# EAGLE schematic Circular_Touch_Pad (EAGLE 9.3.0)
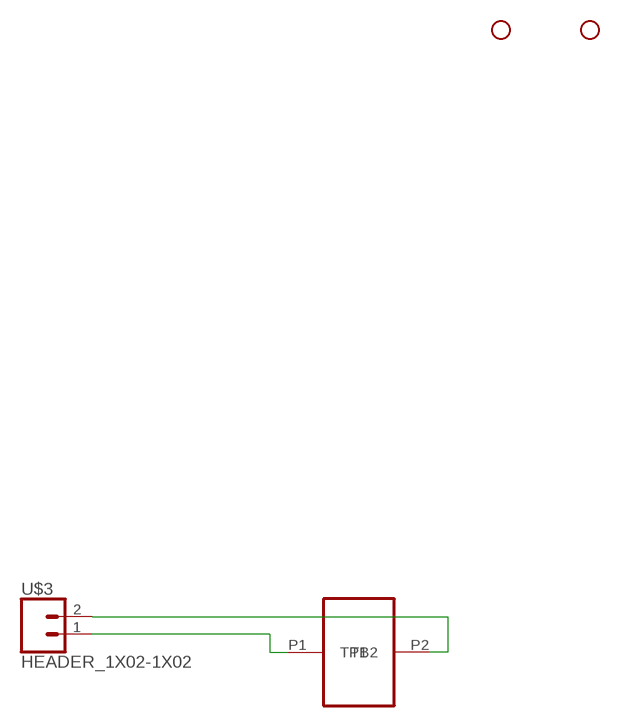
[diagram p0: schematic, sheet 1]

## Parts
H1  STAND-OFF-  [STAND-OFF]
H2  STAND-OFF-  [STAND-OFF]
U$1  TOUCH-PAD-CIRCLE  [TOUCH-PAD2]
U$3  HEADER_1X02-1X02  [1X02]

## Nets
N$1: U$1.P1(TP1) U$3.1
N$2: U$1.P2(TB2) U$3.2

## Library data of the parts
H1 H2 = MMC Eagle:STAND-OFF-
U$1 = MMC Eagle:TOUCH-PAD-
U$3 = MMC Eagle:HEADER_1X02-